# Altium schematic sheet 05_Sensors.SchDoc
size A4; SheetNumber: 5; SheetTotal: 9
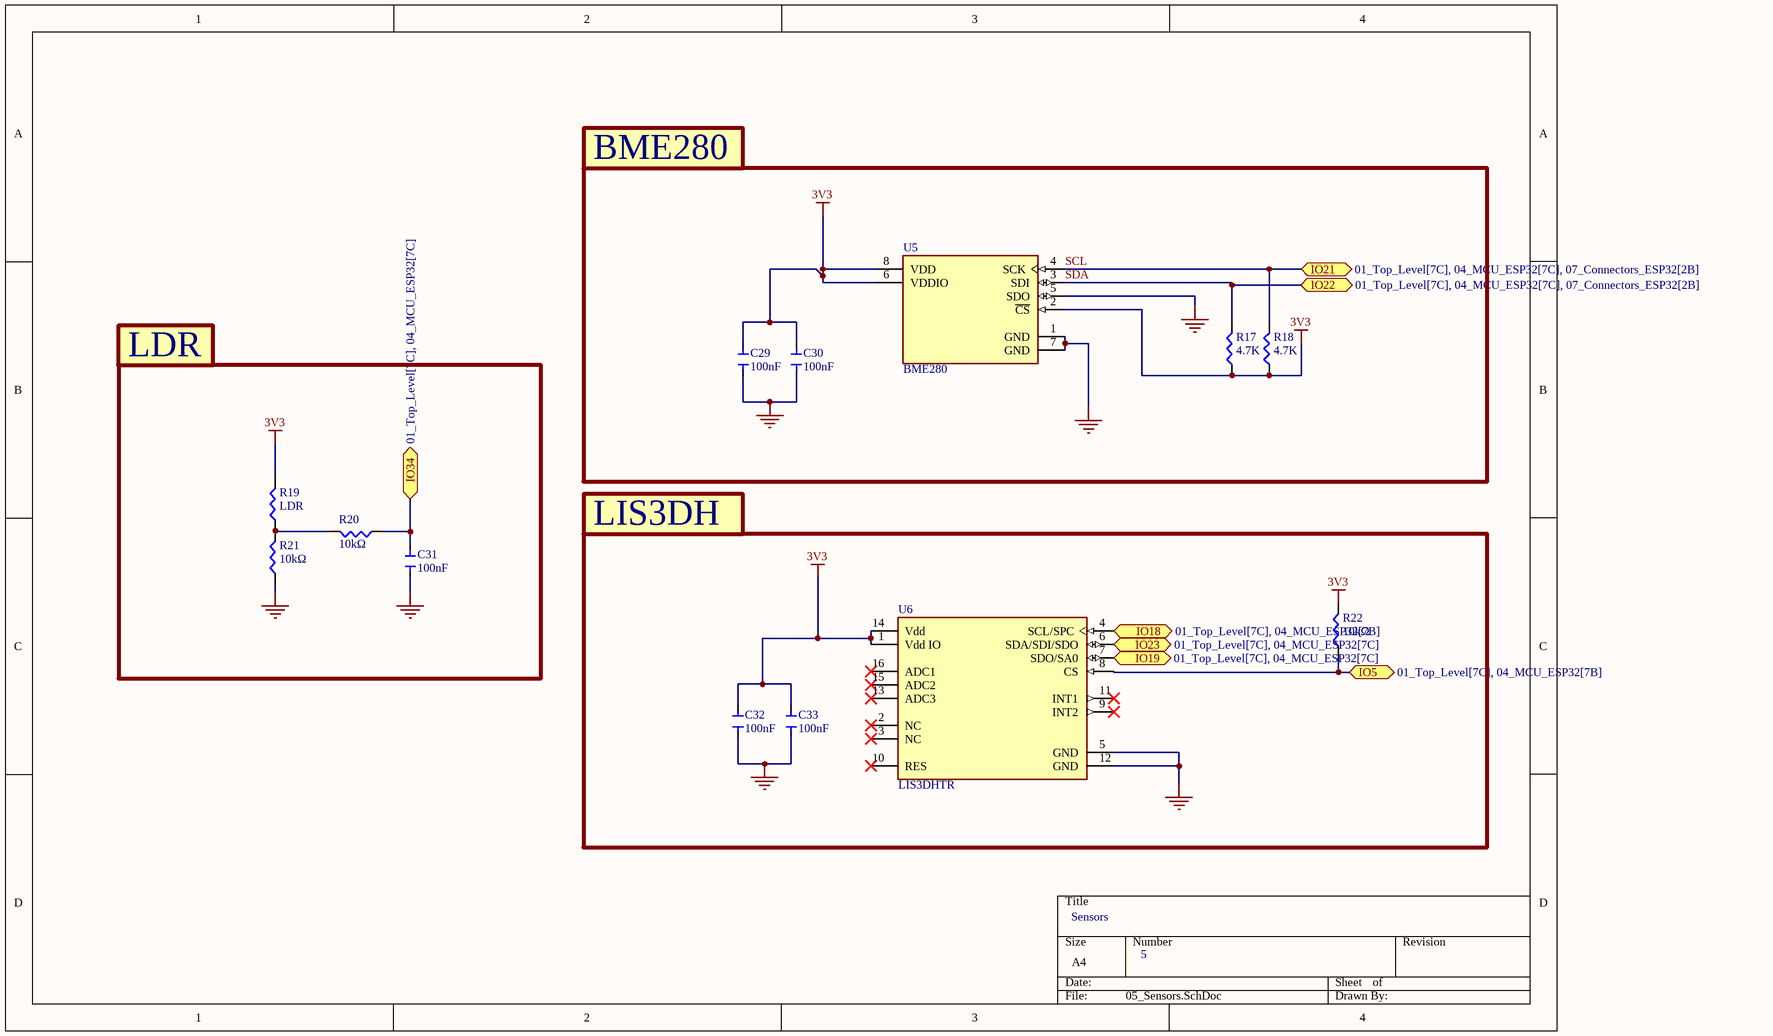
[diagram p0: 05_Sensors.SchDoc]

## Parts
C29  100nF  [CAP_100nF]
C30  100nF  [CAP_100nF]
C31  100nF  [CAP_100nF]
C32  100nF  [CAP_100nF]
C33  100nF  [CAP_100nF]
R17  4.7K  [RES_2K]
R18  4.7K  [RES_2K]
R19  LDR  [RES_2K]
R20  10kΩ  [RES_10K]
R21  10kΩ  [RES_10K]
R22  10kΩ  [RES_10K]
U5  BME280  [FP-BME280-MFG]
U6  LIS3DHTR  [FP-LGA-16-7983231-MFG]

## Blocks framed on the sheet
BME280: C29 C30 R17 R18 U5
LDR: C31 R19-R21
LIS3DH: C32 C33 R22 U6

## Ports
IO5 (bidir, see 01_Top_Level[7C], 04_MCU_ESP32[7B]), IO18 (bidir, see 01_Top_Level[7C], 04_MCU_ESP32[7B]), IO19 (bidir, see 01_Top_Level[7C], 04_MCU_ESP32[7C]), IO21 (bidir, see 01_Top_Level[7C], 04_MCU_ESP32[7C], 07_Connectors_ESP32[2B]), IO22 (bidir, see 01_Top_Level[7C], 04_MCU_ESP32[7C], 07_Connectors_ESP32[2B]), IO23 (bidir, see 01_Top_Level[7C], 04_MCU_ESP32[7C]), IO34 (bidir, see 01_Top_Level[7C], 04_MCU_ESP32[7C])

## Nets
3V3: C29.2 C30.2 C32.2 C33.2 R17.1 R18.1 R19.2 R22.2 U5.2(~{CS}) U5.6(VDDIO) U5.8(VDD) U6.1(Vdd_IO) U6.14(Vdd)
GND: C29.1 C30.1 C31.1 C32.1 C33.1 R21.1 U5.1(GND) U5.5(SDO) U5.7(GND) U6.5(GND) U6.12(GND)
IO5: R22.1 U6.8(CS) ; port IO5
IO18: U6.4(SCL/SPC) ; port IO18
IO19: U6.7(SDO/SA0) ; port IO19
IO23: U6.6(SDA/SDI/SDO) ; port IO23
IO34: C31.2 R20.1 ; port IO34
SCL: R18.2 U5.4(SCK) ; port IO21
SDA: R17.2 U5.3(SDI) ; port IO22
NetR19_1: R19.1 R20.2 R21.2

Not connected (* = marked no-connect by the designer): U6 2(NC)* 3(NC)* 9(INT2)* 10(RES)* 11(INT1)* 13(ADC3)* 15(ADC2)* 16(ADC1)*

## Notes on the sheet
- Sensors
- 5

## Library data of the parts
C29-C33 = CAP_100nF: CAP 100nF 50V X7R ±10% 0603 Ceramic Capacitors RoHS; manufacturer: YAGEO; manufacturer part number: CC0603KRX7R9BB104; value: 100nf; supplier: LCSC; supplier part number: C14663; ComponentLink1Description: Datasheet; ComponentLink1URL: https://www.lcsc.com/datasheet/C14663.pdf
R17-R19 = RSE_0603_2K: 100mW 2KΩ 75V Thick Film Resistor ±100ppm/℃ ±1% 0603 Chip Resistor - Surface Mount RoHS; ComponentLink1Description: datasheet; ComponentLink1URL: https://www.lcsc.com/product-detail/C105588.html?s_z=n_resistance%2520100%2520ohm
R20-R22 = RES_0603_10K: 100mW Thin Film Resistor ±0.1% ±10ppm/℃ 10kΩ 0603 Chip Resistor - Surface Mount ROHS; Manufacturer: Yageo Group; Manufacturer Part Number: RT0603BRB07169KL; Manufacturer: YAGEO; Temperature Coefficient: 10ppm/°C; Voltage Rating: 75V; Features: Moisture Resistant; Height: 450µm; Length: 1.6002mm; Lifecycle Status: Production; Max Operating Temperature: 155°C; Max Power Dissipation: 100mW; Min Operating Temperature: -55°C; Mounting Technology: Surface Mount; Number of Terminals: 2; Number of Terminations: 2; Packaging: Tape & Reel; Power Dissipation: 100mW; Power Rating: 100mW; REACH SVHC: Yes; Tolerance: 0.1%; Width: 800µm; Working Voltage: 75V; ComponentLink1URL: https://datasheet.octopart.com:443/RT0603BRB07169KL-Yageo-datasheet-176402239.pdf?src-supplier=IHS; ComponentLink1Description: https://datasheet.octopart.com:443/RT0603BRB07169KL-Yageo-datasheet-176402239.pdf?src-supplier=IHS; ComponentLink2URL: https://datasheet.octopart.com:443/RT0603BRB07169KL-Yageo-datasheet-96443642.pdf?src-supplier=Upverter; ComponentLink2Description: https://datasheet.octopart.com:443/RT0603BRB07169KL-Yageo-datasheet-96443642.pdf?src-supplier=Upverter; ComponentLink3URL: https://datasheet.octopart.com:443/RT0603BRB07169KL-Yageo-Group-datasheet-141265893.pdf?src-supplier=ODG+(Origin+Data+Global); ComponentLink3Description: https://datasheet.octopart.com:443/RT0603BRB07169KL-Yageo-Group-datasheet-141265893.pdf?src-supplier=ODG+(Origin+Data+Global); ComponentLink4URL: https://datasheet.octopart.com/RT0603BRB07169KL-Yageo-datasheet-86813807.pdf; ComponentLink4Description: https://datasheet.octopart.com/RT0603BRB07169KL-Yageo-datasheet-86813807.pdf; ComponentLink5URL: http://sigma.octopart.com:80/conflict_mineral_statement/Yageo-company-3.pdf?src-supplier=Compliance+Statements; ComponentLink5Description: http://sigma.octopart.com:80/conflict_mineral_statement/Yageo-company-3.pdf?src-supplier=Compliance+Statements; ComponentLink6URL: http://sigma.octopart.com:80/rohs_statement/Yageo-company-2.pdf?src-supplier=Compliance+Statements; ComponentLink6Description: http://sigma.octopart.com:80/rohs_statement/Yageo-company-2.pdf?src-supplier=Compliance+Statements; Supplier: LCSC; Supplier Part Number: C860143; Datasheet Link: https://www.lcsc.com/datasheet/C860143.pdf
U5 = CMP-2000-05073-3: SENSOR PRESSURE HUMIDITY TEMP; Sensor Type: Temperature; Accuracy: 3%; Response Time: 1s; Output Type: SPI; Min Operating Temperature: -40°C; Max Operating Temperature: 85°C; Case/Package: LGA; Packaging: Cut Tape; Mount: Surface Mount; Lead Free: Lead Free; Number of Pins: 8
U6 = CMP-0234-00055-6: ACCEL 2-16G I2C/SPI 16LGA; Max Supply Voltage: 3.6V; Bandwidth: 5kHz; Min Supply Voltage (DC): 1.71V; Interface: I2C; Axis: X, Y, Z; Operating Supply Voltage: 2.5V; Operating Supply Current: 11uA; Output Type: Digital; Resolution: 16b; Sensor Type: 3 Axis; Series: -; Package Quantity: 1; Case/Package: LGA; Radiation Hardening: No; Min Operating Temperature: -40°C; Length: 3mm; Max Supply Voltage (DC): 3.6V; Lead Free: Lead Free; Height: 1mm; Number of Pins: 16; RoHS Compliant: Yes; Packaging: Tape and Reel; Width: 3mm; Contact Plating: Gold; Max Operating Temperature: 85°C; Min Supply Voltage: 1.71V; REACH SVHC: No SVHC; Depth: 3mm